# EAGLE design usb-gamepad (EAGLE 6.5.0)
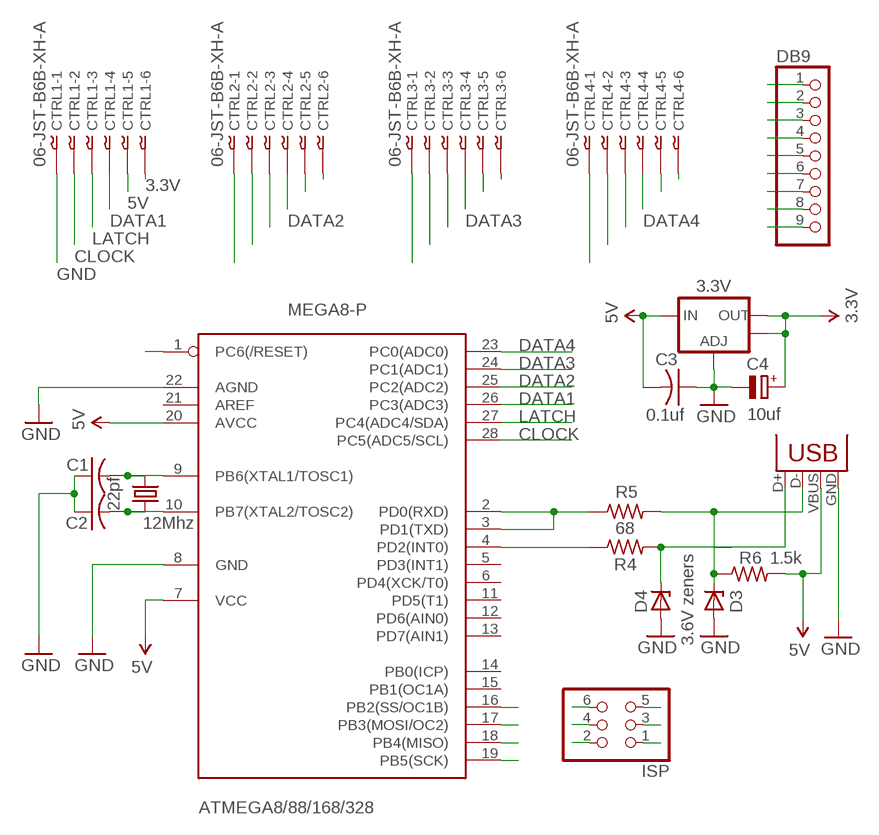
[diagram p0: schematic, sheet 1]

## Parts
3.3V  V_REG_LM1117SOT223  [SOT223]
ATMEGA8/88/168/328  MEGA8-P  [DIL28-3]
C1  22pf  C-US025-025X050  [C025-025X050]
C2  22pf  C-US025-025X050  [C025-025X050]
C3  0.1uf  C-US025-025X050  [C025-025X050]
C4  10uf  CPOL-EUE2.5-5  [E2,5-5]
CTRL1  06-JST-B6B-XH-A  [B6B-XH]
CTRL2  06-JST-B6B-XH-A  [B6B-XH]
CTRL3  06-JST-B6B-XH-A  [B6B-XH]
CTRL4  06-JST-B6B-XH-A  [B6B-XH]
D3  3.6V zeners  1N4728  [DO41Z10]
D4  3.6V  1N4728  [DO41Z10]
DB9  PINHD-1X9  [1X09]
ISP  PINHD-2X3  [2X03]
Q1  12Mhz  CRYSTALHC49S  [HC49/S]
R4  68  R-US_0207/10  [0207/10]
R5  68  R-US_0207/10  [0207/10]
R6  1.5k  R-US_0207/10  [0207/10]
USB  USBPTH  [USB-B-PTH]

## Nets
3.3V: 3.3V.2(OUT) 3.3V.4(OUT) C4.+ CTRL1.P$6 CTRL2.P$6 CTRL3.P$6 CTRL4.P$6
5V: 3.3V.3(IN) ATMEGA8/88/168/328.7(VCC) ATMEGA8/88/168/328.20(AVCC) C3.2 CTRL1.P$5 CTRL2.P$5 CTRL3.P$5 CTRL4.P$5 DB9.5 ISP.2 R6.2 USB.VBUS
CLOCK: ATMEGA8/88/168/328.28(PC5(ADC5/SCL)) CTRL1.P$2 CTRL2.P$2 CTRL3.P$2 CTRL4.P$2 DB9.1
D+: D4.C R4.2 USB.D+
D-: D3.C R5.2 R6.1 USB.D-
DATA1: ATMEGA8/88/168/328.26(PC3(ADC3)) CTRL1.P$4 DB9.3
DATA2: ATMEGA8/88/168/328.25(PC2(ADC2)) CTRL2.P$4 DB9.4
DATA3: ATMEGA8/88/168/328.24(PC1(ADC1)) CTRL3.P$4 DB9.6
DATA4: ATMEGA8/88/168/328.23(PC0(ADC0)) CTRL4.P$4 DB9.7
GND: 3.3V.1(ADJ) ATMEGA8/88/168/328.8(GND) ATMEGA8/88/168/328.22(AGND) C1.1 C2.1 C3.1 C4.- CTRL1.P$1 CTRL2.P$1 CTRL3.P$1 CTRL4.P$1 D3.A D4.A DB9.8 ISP.6 USB.GND
LATCH: ATMEGA8/88/168/328.27(PC4(ADC4/SDA)) CTRL1.P$3 CTRL2.P$3 CTRL3.P$3 CTRL4.P$3 DB9.2
MISO: ATMEGA8/88/168/328.18(PB4(MISO)) ISP.1
MOSI: ATMEGA8/88/168/328.17(PB3(MOSI/OC2)) ISP.4
N$1: ATMEGA8/88/168/328.10(PB7(XTAL2/TOSC2)) C2.2 Q1.1
N$2: ATMEGA8/88/168/328.9(PB6(XTAL1/TOSC1)) C1.2 Q1.2
N$5: ATMEGA8/88/168/328.2(PD0(RXD)) ATMEGA8/88/168/328.3(PD1(TXD)) R5.1
N$6: ATMEGA8/88/168/328.4(PD2(INT0)) R4.1
RESET: ATMEGA8/88/168/328.1(PC6(/RESET)) ISP.5
SCK: ATMEGA8/88/168/328.19(PB5(SCK)) DB9.9 ISP.3
SS: ATMEGA8/88/168/328.16(PB2(SS/OC1B))
Unconnected: ATMEGA8/88/168/328.5(PD3(INT1)) ATMEGA8/88/168/328.6(PD4(XCK/T0)) ATMEGA8/88/168/328.11(PD5(T1)) ATMEGA8/88/168/328.12(PD6(AIN0)) ATMEGA8/88/168/328.13(PD7(AIN1)) ATMEGA8/88/168/328.14(PB0(ICP)) ATMEGA8/88/168/328.15(PB1(OC1A)) ATMEGA8/88/168/328.21(AREF)

## Library data of the parts
3.3V = SparkFun:V_REG_LM1117: Voltage Regulator LM1117 Standard adjustable voltage regulator but in SMD form. Spark Fun Electronics SKU : COM-00595
ATMEGA8/88/168/328 = atmel:MEGA8-P: MICROCONTROLLER 8 Kbytes FLASH, 1 kbytes SRAM, 512 bytes EEPROM, USART, 4-channel 10 bit ADC, 2-channel 8 bit ADC Pin compatible with Atmega48, ATMega88, ATMega168 Source: avr.lbr
C1-C3 = resistor:C-US: CAPACITOR, American symbol
C4 = resistor:CPOL-EU: POLARIZED CAPACITOR, European symbol
CTRL1-CTRL4 = con-jst-xh:06-JST: JST CONNECTOR
D3 D4 = diode:1N4728: Z DIODE 3.3 V, 1W, 5 percent
DB9 = pinhead:PINHD-1X9: PIN HEADER
ISP = pinhead:PINHD-2X3: PIN HEADER
Q1 = crystal:CRYSTAL: CRYSTAL
R4-R6 = resistor:R-US_: RESISTOR, American symbol
USB = SparkFun:USB: USB Connectors USB-B-PTH is fully proven SKU : PRT-00139 USB-miniB is fully proven SKU : PRT-00587 USB-A-PCB is untested. USB-A-H is throughly reviewed, but untested. Spark Fun Electronics SKU : PRT-00437 USB-B-SMT is throughly reviewed, but untested. Needs silkscreen touching up. USB-A-S has not been used/tested USB-MB-H has not been used/tested

## Board
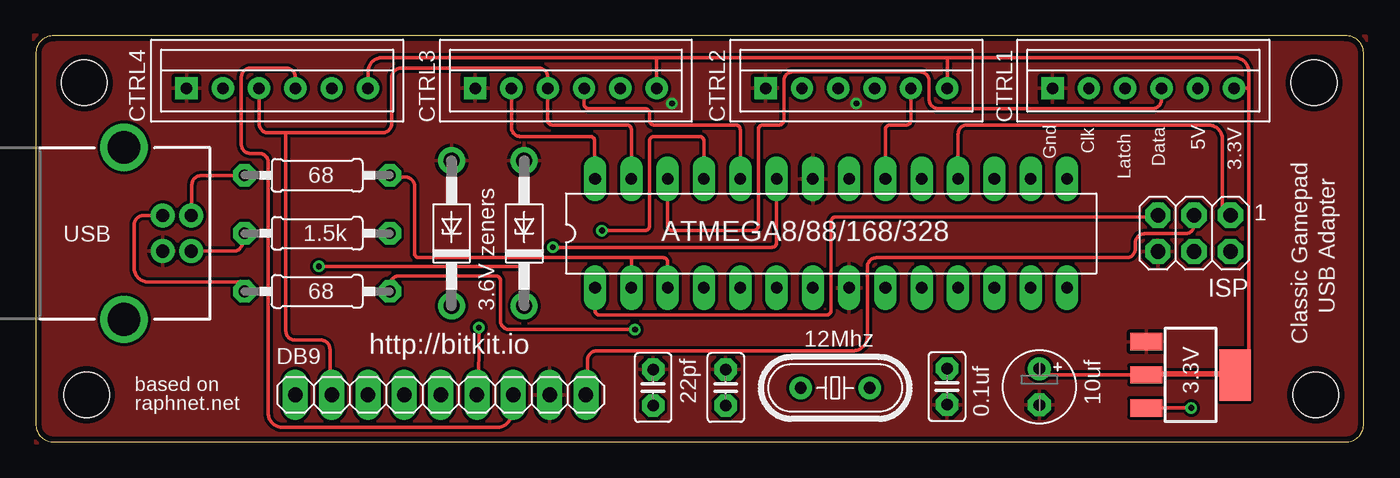
[diagram p1: board, top side]
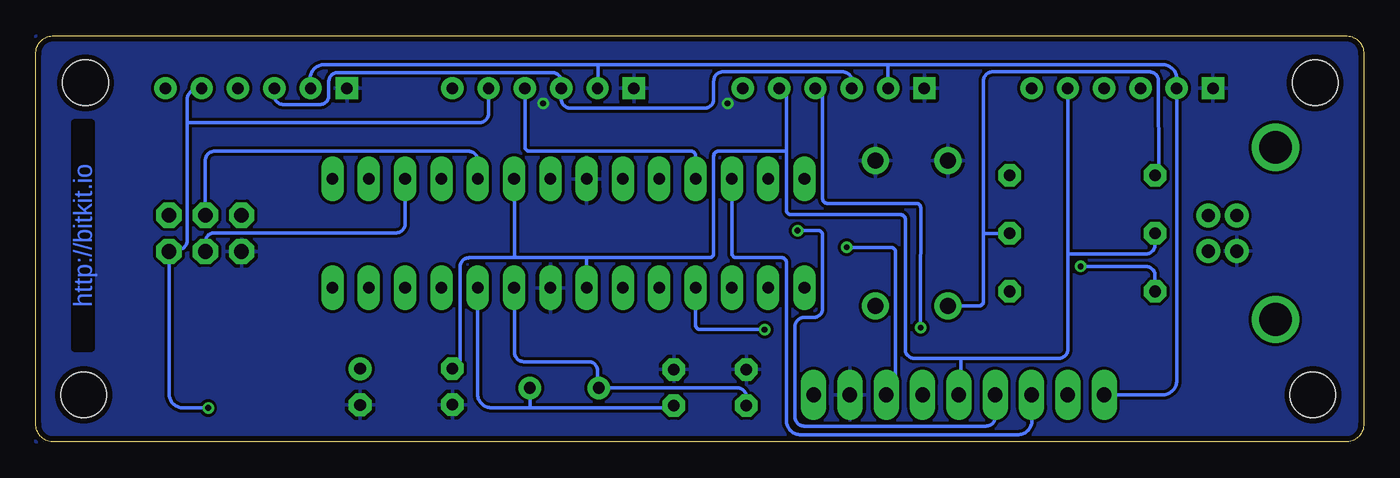
[diagram p2: board, bottom side, seen from below]

Size 92.89 x 28.44 mm. Coordinates in mm from the lower left corner, seen from the top.
Outline: 92.89,27.17 arc90 91.62,28.44 1.27,28.44 arc90 0,27.17 0,1.27 arc90 1.27,0 91.62,0 arc90 92.89,1.27 92.89,27.17
Copper layers (1*16): Top 0.035mm / dielectric 1.5mm / Bottom 0.035mm
Design rules "default *": minimum track width 10mil, minimum drill 24mil, track to track 8mil, track to pad 8mil, pad to pad 6mil, via to via 6mil, smd to smd 6mil, copper to edge 15mil, drill to drill 8mil, minimum pad ring 15mil, minimum via ring 8mil, stop-mask expansion 4mil, vias tented up to drill 0.4mm, thermal gap 10mil
Holes 3.2 mm at 3.4,25.15 3.56,3.3 89.53,3.3 89.41,25.15
vRestrict: area 27,12 to 36,18; area 40.2,14 to 64.2,15.6

### Footprints (pad centres in the part's own frame; a part is rotated, then mirrored left to right if it is on the bottom)
SOT223 = smd 1.219 x 2.235: 1 -2.311,-3.099; 2 0,-3.099; 3 2.311,-3.099 | smd 3.6 x 2.2: 4 0,3.099
DIL28-3 = drill 0.813 long: 1 -16.51,-3.81; 2 -13.97,-3.81; 3 -11.43,-3.81; 4 -8.89,-3.81; 5 -6.35,-3.81; 6 -3.81,-3.81; 7 -1.27,-3.81; 8 1.27,-3.81; 9 3.81,-3.81; 10 6.35,-3.81; 11 8.89,-3.81; 12 11.43,-3.81; 13 13.97,-3.81; 14 16.51,-3.81; 15 16.51,3.81; 16 13.97,3.81; 17 11.43,3.81; 18 8.89,3.81; 19 6.35,3.81; 20 3.81,3.81; 21 1.27,3.81; 22 -1.27,3.81; 23 -3.81,3.81; 24 -6.35,3.81; 25 -8.89,3.81; 26 -11.43,3.81; 27 -13.97,3.81; 28 -16.51,3.81
C025-025X050 = drill 0.813 octagon: 1 -1.27,0; 2 1.27,0
E2,5-5 = drill 0.813 pad 1.6: + -1.27,0 | drill 0.813 pad 1.6 octagon: - 1.27,0
B6B-XH = drill 0.8 square: P$1 -6.35,0 | drill 0.8: P$2 -3.81,0; P$3 -1.27,0; P$4 1.27,0; P$5 3.81,0; P$6 6.35,0
DO41Z10 = drill 1.118: A 5.08,0; C -5.08,0
1X09 = drill 1.016 long: 1 -10.16,0; 2 -7.62,0; 3 -5.08,0; 4 -2.54,0; 5 0,0; 6 2.54,0; 7 5.08,0; 8 7.62,0; 9 10.16,0
2X03 = drill 1.016 octagon: 1 -2.54,-1.27; 2 -2.54,1.27; 3 0,-1.27; 4 0,1.27; 5 2.54,-1.27; 6 2.54,1.27
HC49/S = drill 0.813: 1 -2.413,0; 2 2.413,0
0207/10 = drill 0.813 octagon: 1 -5.08,0; 2 5.08,0
USB-B-PTH = drill 0.914: D+ 0,1.25; D- 1.981,1.25; GND 0,-1.25; VBUS 1.981,-1.25 | drill 2.286: P$1 -2.718,-6.02; P$2 -2.718,6.02

### Placement (x,y rotation side)
3.3V  80.77,4.7 270 top
ATMEGA8/88/168/328  55.63,14.61 0 top
C1  43.18,3.81 270 top
C2  48.26,3.81 270 top
C3  63.74,3.88 90 top
C4  70.2,3.86 270 top
CTRL1  77.47,24.77 0 top
CTRL2  57.4,24.77 0 top
CTRL3  37.08,24.77 0 top
CTRL4  16.89,24.77 0 top
D3  29.08,14.61 90 top
D4  34.16,14.61 90 top
DB9  28.32,3.3 0 top
ISP  81.03,14.61 180 top
Q1  55.92,3.79 180 top
R4  19.68,10.54 180 top
R5  19.68,18.67 180 top
R6  19.68,14.61 180 top
USB  8.89,14.61 0 top

### Tracks (layer width: path | path; a pad name or v marks a point on that pad's centre or on a via)
3.3V
  Top 0.254: 84.85,24.77 84.85,5.59 84.07,4.83 3.3V.4 | 3.3V.4 3.3V.2 | 3.3V.2 70.2,4.7 C4.+ | 3.3V.2 77.72,4.83 83.82,4.83 3.3V.4 | CTRL4.P$6 23.24,25.9 arc-90 24.24,26.9 43.43,26.9 | 43.43,26.9 63.75,26.9 | 84.85,24.77 84.85,25.9 arc90 83.85,26.9 63.75,26.9 | CTRL1.P$6 84.85,24.77 | CTRL3.P$6 43.43,26.9 | CTRL2.P$6 63.75,26.9
5V  (via drill 0.4)
  Top 0.254: USB.VBUS 10.92,13.36 13.84,13.36 arc90 14.48,14 14.48,14.48 R6.2 | v80.82,2.39 3.3V.3 | ATMEGA8/88/168/328.20 59.44,21.88 arc-90 59.75,22.2 60.9,22.2 arc90 61.21,22.51 CTRL2.P$5
  Bottom 0.254: 20.7,13.16 CTRL4.P$5 | R6.2 14.61,13.8 arc90 15.24,13.16 20.7,13.16 | 28.18,5.85 28.18,4.02 28.19,3.3 DB9.5 | 20.7,13.16 20.7,6.49 arc90 21.34,5.85 28.18,5.85 | v80.82,2.39 82.57,2.39 arc90 83.57,3.39 ISP.2 83.57,13.46 82.93,13.46 arc-90 82.3,14.1 82.3,22.35 | 82.3,22.35 82.3,24 arc90 81.66,24.64 81.28,24.64 CTRL1.P$5 | 59.41,12.9 62.57,12.9 arc-90 63.21,12.27 63.21,5.13 63.5,5.33 C3.2 | 59.41,12.9 59.41,18.29 ATMEGA8/88/168/328.20 | 40.38,20.35 45.15,20.35 arc-90 45.47,20.04 45.47,13.22 arc90 45.78,12.9 54.36,12.9 | 40.38,20.35 40.38,24.74 CTRL3.P$5 | ATMEGA8/88/168/328.7 54.36,12.9 | 54.36,12.9 59.41,12.9 | CTRL2.P$5 61.21,22.99 arc90 61.85,22.35 82.3,22.35 | 40.38,20.35 40.38,16.23 arc-90 40.06,15.91 32.38,15.91 arc90 32.07,15.59 32.07,6.49 arc-90 31.43,5.85 28.18,5.85
CLOCK
  Top 0.254: CTRL3.P$2 33.27,22.02 arc90 33.91,21.38 38.78,21.38 arc-90 39.1,21.07 39.1,18.5 39.12,18.44 ATMEGA8/88/168/328.28
  Bottom 0.254: 33.27,26.42 14.08,26.42 arc90 13.08,25.42 CTRL4.P$2 13.08,4.3 arc90 14.08,3.3 DB9.1 | CTRL3.P$2 33.27,26.42 | 53.57,26.42 53.57,24.89 CTRL2.P$2 | 33.27,26.42 53.57,26.42 | 53.57,26.42 72.7,26.42 arc-90 73.7,25.42 73.7,25.35 73.66,24.59 CTRL1.P$2
D+  (via drill 0.4)
  Top 0.254: USB.D+ 7.52,15.86 arc90 6.88,15.22 6.88,12.2 arc90 7.88,11.2 14.48,11.2 R4.2 | v19.81,12.29 33.85,12.29 arc-90 34.16,11.97 D4.C
  Bottom 0.254: R4.2 14.61,11.66 arc-90 15.24,12.29 v19.81,12.29
D-
  Top 0.254: R5.2 14.48,18.64 11.56,18.64 arc90 10.92,18.01 10.92,16 USB.D-
  Bottom 0.254: 26.6,14.61 26.6,9.84 arc90 26.92,9.53 D3.C | R5.2 14.55,18.71 14.35,18.78 14.36,25.27 arc-90 14.99,25.91 25.96,25.91 arc-90 26.6,25.27 26.6,14.61 | R6.1 26.6,14.61
DATA1
  Top 0.254: CTRL1.P$4 78.74,23.97 arc-90 78.11,23.34 63.12,23.34 arc-90 62.48,23.97 62.48,25.27 arc90 61.85,25.91 52.96,25.91 arc90 52.32,25.27 52.32,22.51 arc-90 52.01,22.2 50.86,22.2 arc90 50.55,21.88 50.55,15.12 arc-90 50.23,14.8 44.51,14.8 arc-90 44.2,15.12 ATMEGA8/88/168/328.26
  Bottom 0.254: ATMEGA8/88/168/328.26 44.2,13.22 arc-90 43.88,12.9 40.7,12.9 arc90 40.39,12.58 40.39,1.51 arc-90 39.39,0.51 24.21,0.51 arc-90 23.21,1.51 23.21,3.3 DB9.3
DATA2  (via drill 0.4)
  Top 0.254: ATMEGA8/88/168/328.25 46.74,21.07 arc90 46.42,21.38 43.24,21.38 arc90 42.93,21.07 42.93,15.12 arc-90 42.61,14.8 v39.6,14.8
  Bottom 0.254: CTRL2.P$4 58.67,20.67 arc-90 58.36,20.35 47.05,20.35 arc90 46.74,20.04 ATMEGA8/88/168/328.25 | v39.6,14.8 38.16,14.8 arc90 37.85,14.48 37.85,9.36 arc90 38.48,8.72 39.14,8.72 arc-90 39.78,8.09 39.78,1.75 arc-90 39.14,1.12 26.42,1.12 arc-90 25.78,1.75 DB9.4
DATA3  (via drill 0.4)
  Top 0.254: CTRL3.P$4 38.35,23.66 arc90 38.67,23.34 42.61,23.34 arc-90 42.93,23.02 42.93,22.51 arc90 43.24,22.2 48.96,22.2 arc-90 49.28,21.88 ATMEGA8/88/168/328.24 | v31,8 30.99,3.3 DB9.6
  Bottom 0.254: v31,8 31,9.91 30.99,16.39 arc-90 31.31,16.71 37.53,16.71 arc90 37.85,17.02 37.85,24.63 38.35,24.64 CTRL3.P$4
DATA4  (via drill 0.4)
  Top 0.254: CTRL4.P$4 18.16,25.53 arc90 17.53,26.16 15.01,26.16 arc90 14.38,25.53 14.38,20.84 arc90 15.01,20.2 15.63,20.2 arc-90 16.26,19.57 16.26,2.02 arc90 17.26,1.02 32.27,1.02 arc90 33.27,2.02 33.27,3.3 DB9.7 | v36.16,13.63 51.5,13.63 arc90 51.82,13.95 ATMEGA8/88/168/328.23
  Bottom 0.254: v36.16,13.63 33.08,13.63 arc90 32.76,13.31 32.76,3.05 33.43,3.05 33.43,3.3 DB9.7
GND  (via drill 0.4)
  other vias: 44.5,23.7 57.4,23.7
  pour Bottom: 0.1,28.4 92.9,28.4 92.9,0 0.1,0
  pour Top: -0.15,28.5 93.05,28.4 92.95,0.15 0,-0.1
LATCH
  Top 0.254: ATMEGA8/88/168/328.27 41.66,21.88 arc90 41.34,22.2 36.13,22.2 arc-90 35.81,22.51 CTRL3.P$3 35.81,25.53 arc90 35.18,26.16 25.53,26.16 arc90 24.89,25.53 24.89,22.28 arc-90 24.26,21.64 17.5,21.64 | 17.5,21.64 16.26,21.64 arc-90 15.62,22.28 CTRL4.P$3 | 17.5,21.64 17.5,7.77 arc90 18.13,7.13 19.94,7.13 arc-90 20.57,6.5 20.57,3.3 DB9.2
  Bottom 0.254: CTRL1.P$3 76.2,24.26 arc-90 75.56,23.62 73.03,23.62 arc-90 72.39,24.26 72.39,25.23 arc90 71.75,25.86 56.77,25.86 arc90 56.13,25.23 CTRL2.P$3 56.13,24 arc-90 55.5,23.37 46.1,23.37 arc-90 45.47,24 45.47,25.27 arc90 44.83,25.91 36.45,25.91 arc90 35.81,25.27 CTRL3.P$3
MISO
  Top 0.254: ATMEGA8/88/168/328.18 64.52,21.56 arc-90 65.15,22.2 82,22.2 arc-90 83,21.2 83,15.88 ISP.1
MOSI
  Bottom 0.254: ISP.4 81.03,14 arc90 80.39,14.64 67.69,14.64 arc-90 67.06,15.27 ATMEGA8/88/168/328.17
N$1
  Bottom 0.254: ATMEGA8/88/168/328.10 62,10.79 62,3.4 arc-90 61,2.4 58.3,2.4 | 58.3,2.4 48.26,2.4 C2.2 | Q1.1 58.3,3.79 58.3,2.4
N$2
  Bottom 0.254: ATMEGA8/88/168/328.9 59.44,10.67 59.4,10.6 59.4,6.26 arc-90 58.77,5.63 54.23,5.63 arc90 53.59,4.99 53.59,3.81 Q1.2 43.81,3.79 arc90 43.18,3.15 C1.2
N$5
  Top 0.254: 41.66,12.9 26.81,12.9 arc-90 26.49,13.22 26.49,17.91 arc90 25.86,18.54 24.89,18.54 R5.1 | 41.66,12.9 43.88,12.9 arc-90 44.2,12.58 ATMEGA8/88/168/328.3 | 41.66,12.9 ATMEGA8/88/168/328.2
N$6  (via drill 0.4)
  Top 0.254: R4.1 24.77,10.99 arc-90 25.4,11.62 32.19,11.62 arc-90 32.5,11.3 32.5,8.51 arc90 33.14,7.87 v41.91,7.87
  Bottom 0.254: ATMEGA8/88/168/328.4 46.74,8.19 arc-90 46.42,7.87 v41.91,7.87
RESET
  Top 0.254: ATMEGA8/88/168/328.1 39.12,9.21 arc90 39.43,8.89 55.31,8.89 arc90 55.63,9.21 55.63,15.43 arc-90 55.94,15.75 78.49,15.75 ISP.5
SCK
  Top 0.254: ISP.3 81.03,15.21 arc-90 80.39,14.58 77.55,14.58 arc90 76.92,13.94 76.92,13.54 arc-90 76.28,12.9 58.8,12.9 arc90 58.17,12.27 58.17,7.38 arc-90 57.17,6.38 39.23,6.38 arc90 38.59,5.74 38.61,3.3 DB9.9
  Bottom 0.254: ATMEGA8/88/168/328.19 61.98,19.72 arc-90 62.61,20.35 80.39,20.35 arc-90 81.03,19.72 ISP.3

### Text on the board
Bottom: http://bitkit.io | http://bitkit.io
tNames: Gnd | Clk | 5V | Data | 3.3V | Latch | 1 | USB Adapter | Classic Gamepad | http://bitkit.io | based on | raphnet.net
bStop: http://bitkit.io | http://bitkit.io | http://bitkit.io | http://bitkit.io | http://bitkit.io | http://bitkit.io | http://bitkit.io | http://bitkit.io